# Altium project relay.PrjPcb
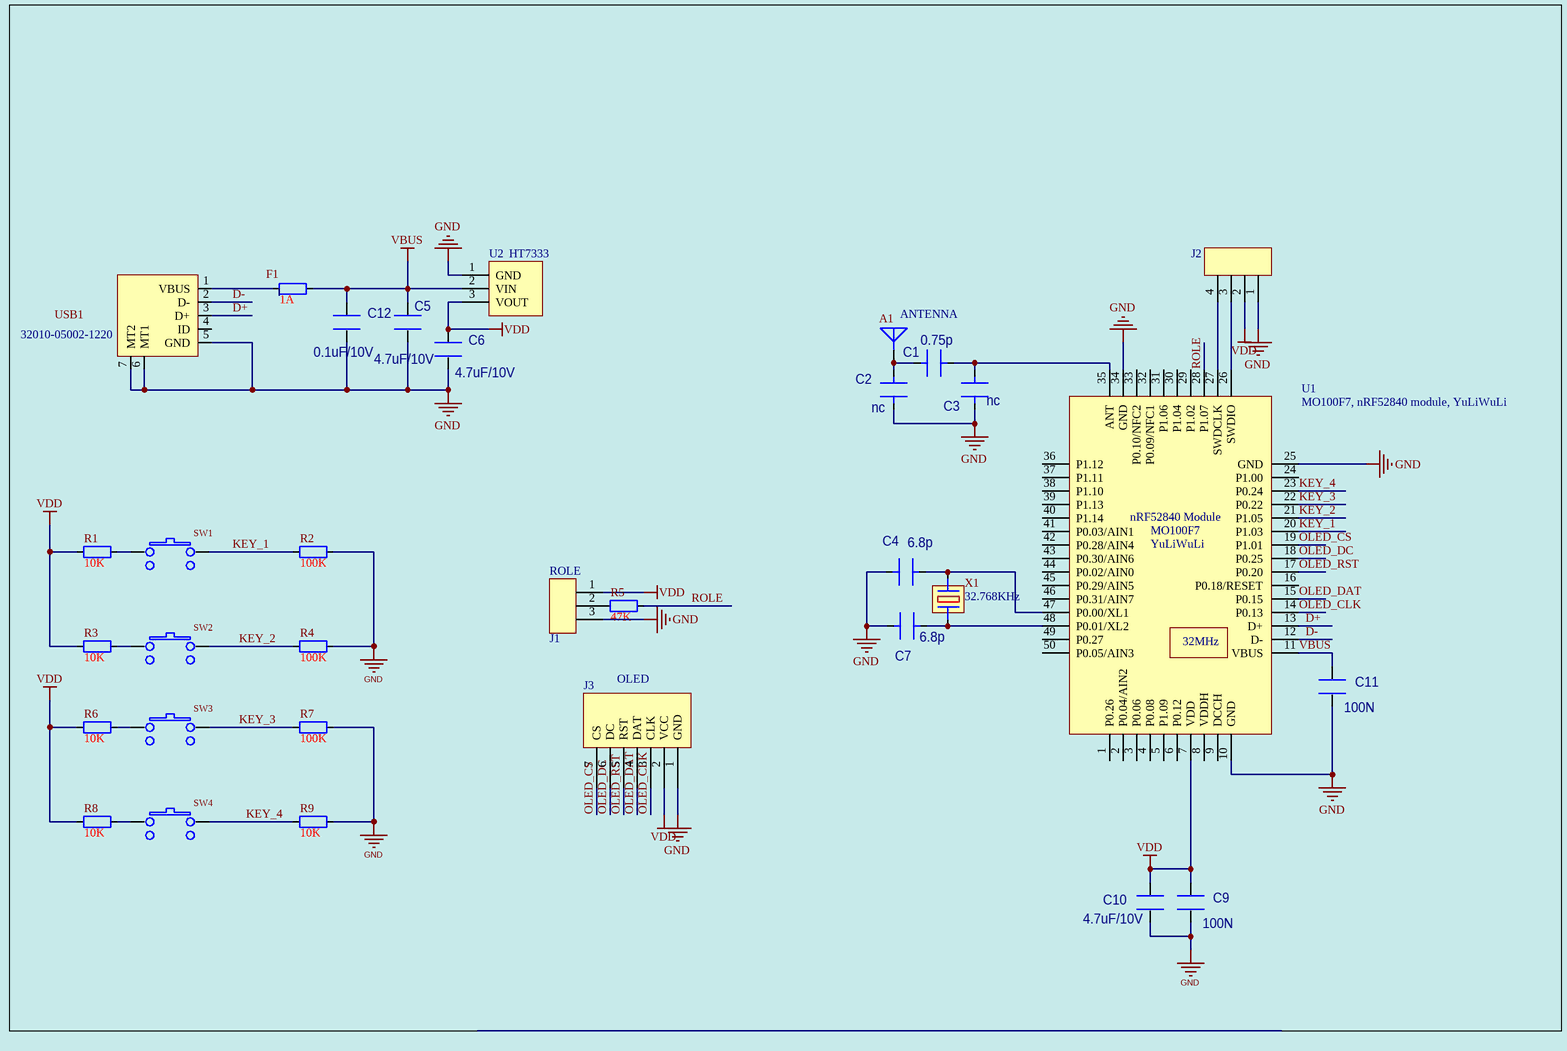
[diagram p0: relay.SchDoc]
1 sheet, 33 parts. Net scope: global (net labels, ports and power ports of the same name join across sheets).
Board file: relay.PcbDoc

## Sheet relay.SchDoc
size A4; PageSetup: Record=PageOptions|CenterHorizontal=True|CenterVertical=True|PrintScale=1.39|XCorrection=1.00|YCorrection=1.00|PrintKind=1|BorderSize=5000000|LeftOffset=0|BottomOffset=0|Orientation=2|PaperLength=1000|PaperWidth=1000|Scale=100|PaperSource=15|PrintQuality=600|MediaType=1|DitherType=10|PrintScaleMode=1|PaperKind=A3|PaperIndex=8; Total Page: 1/1

### Parts
A1  ANTENNA  [AN2]
C1  value 0.75p  [cap0603(1608)]  (hidden comment: CAP)
C2  value nc  [cap0603(1608)]  (hidden comment: CAP)
C3  value nc  [cap0603(1608)]  (hidden comment: CAP)
C4  value 6.8p  [cap0603(1608)]  (hidden comment: CAP)
C5  value 4.7uF/10V  [cap0603(1608)]  (hidden comment: CC103)
C6  value 4.7uF/10V  [cap0603(1608)]  (hidden comment: CC103)
C7  value 6.8p  [cap0603(1608)]  (hidden comment: CAP)
C9  value 100N  [cap0603(1608)]  (hidden comment: CC103)
C10  value 4.7uF/10V  [cap0603(1608)]  (hidden comment: CC103)
C11  value 100N  [cap0603(1608)]  (hidden comment: CC103)
C12  value 0.1uF/10V  [cap0603(1608)]  (hidden comment: CC103)
F1  1A  [RESC0603(1608)_N]
J1  ROLE  [HEAD-1x3-2.54]
J2  HEAD-1x4  [HEAD-1x4-2.54]  (value not drawn)
J3  OLED  [OLED_mod_0.96_1]
R1  10K  [RESC0603(1608)_N]
R2  100K  [RESC0603(1608)_N]
R3  10K  [RESC0603(1608)_N]
R4  100K  [RESC0603(1608)_N]
R5  47K  [RESC0603(1608)_N]
R6  10K  [RESC0603(1608)_N]
R7  100K  [RESC0603(1608)_N]
R8  10K  [RESC0603(1608)_N]
R9  10K  [RESC0603(1608)_N]
SW1  TACT  [SW_6X6X5mm]  (value not drawn)
SW2  TACT  [SW_6X6X5mm]  (value not drawn)
SW3  TACT  [SW_6X6X5mm]  (value not drawn)
SW4  TACT  [SW_6X6X5mm]  (value not drawn)
U1  MO100F7, nRF52840 module, YuLiWuLi  [MO100F7]
U2  HT7333  [HT7333-SOT-89]
USB1  32010-05002-1220  [Micro USB]
X1  32.768KHz  [32.768_A]

### Nets
GND: C2.1 C3.2 C4.1 C5.2 C6.2 C7.1 C9.2 C10.2 C11.2 C12.2 J1.3 J2.1 J3.1(GND) R2.1 R4.2 R7.1 R9.1 U1.10(GND) U1.25(GND) U1.34(GND) U2.1(GND) USB1.5(GND) USB1.6(MT1) USB1.7(MT2)
VBUS: C5.1 C11.1 C12.1 F1.1 U1.11(VBUS) U2.2(VIN)
VDD: C6.1 C9.1 C10.1 J1.1 J2.2 J3.2(VCC) R1.2 R3.2 R6.2 R8.2 U1.7(VDD) U2.3(VOUT)
D+: U1.13(D+) USB1.3(D+)
D-: U1.12(D-) USB1.2(D-)
KEY_1: R2.2 SW1.1 U1.20(P1.03)
KEY_2: R4.1 SW2.1 U1.21(P1.05)
KEY_3: R7.2 SW3.1 U1.22(P0.22)
KEY_4: R9.2 SW4.1 U1.23(P0.24)
OLED_CLK: J3.3(CLK) U1.14(P0.13)
OLED_CS: J3.7(CS) U1.19(P1.01)
OLED_DAT: J3.4(DAT) U1.15(P0.15)
OLED_DC: J3.6(DC) U1.18(P0.25)
OLED_RST: J3.5(RST) U1.17(P0.20)
ROLE: R5.2 U1.28(P1.07)
NetA1_1: A1.1(A) C1.1 C2.2
NetC1_2: C1.2 C3.1 U1.35(ANT)
NetC4_2: C4.2 U1.47(P0.00/XL1) X1.2(OUT)
NetC7_2: C7.2 U1.48(P0.01/XL2) X1.1(IN)
NetF1_2: F1.2 USB1.1(VBUS)
NetJ1_2: J1.2 R5.1
NetJ2_3: J2.3 U1.26(SWDIO)
NetJ2_4: J2.4 U1.27(SWDCLK)
NetR1_1: R1.1 SW1.2
NetR3_1: R3.1 SW2.2
NetR6_1: R6.1 SW3.2
NetR8_1: R8.1 SW4.2

Not connected (* = marked no-connect by the designer): U1 1(P0.26) 2(P0.04/AIN2) 3(P0.06) 4(P0.08) 5(P1.09) 6(P0.12) 8(VDDH) 9(DCCH) 16(P0.18/RESET) 24(P1.00) 29(P1.02) 30(P1.04) 31(P1.06) 32(P0.09/NFC1) 33(P0.10/NFC2) 36(P1.12) 37(P1.11) 38(P1.10) 39(P1.13) 40(P1.14) 41(P0.03/AIN1) 42(P0.28/AIN4) 43(P0.30/AIN6) 44(P0.02/AIN0) 45(P0.29/AIN5) 46(P0.31/AIN7) 49(P0.27) 50(P0.05/AIN3); USB1 4(ID)

### Notes on the sheet
- (near U1) 32MHz
- Revision History List
- Date
- Revision
- 001
- New Design
- Description
- Project
- Rev
- Approval Date
- Page
- Author
- Approved By
- Document Number
- Info class:
- Strictly confidential
- Title
- Page Title
- Prototype A
- (in symbol MO100F7) nRF52840 Module; YuLiWuLi

### Library data of the parts
A1 = ANTENNA: PCB Antenna
C1-C4 C7 = CAP: PART DESC: DECOUP CAP RADIAL BODY:.270 X.130 CENTERS:.200; PCB DECAL: CAP0603; SPICE PAR2: (C)
C5 C6 C9-C12 = CC103: PART DESC: CERAMIC CAPACITOR; PCB DECAL: CAP0603
F1 R1-R9 = Res: Value: 47K_1%; Publisher: i3tex; PackageReference: 0603; Mounting: SMD
J1 = HEAD-1x3
J3 = OLED_mod_0.96_1
SW1-SW4 = SWITCH_TACT_SPST_2-2_PINS
U1 = MO100F7
USB1 = Component_1: Mirco_USB_5S_B
X1 = Crystal_2PIN